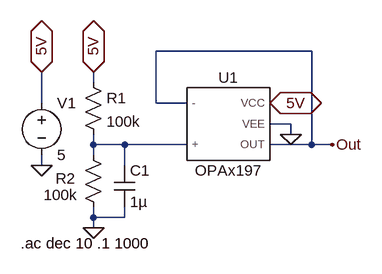
[diagram p0: schematic RefAmp197.asc]
RefAmp197.asc, the LTspice schematic file:
Version 4
SHEET 1 880 680
WIRE 416 64 176 64
WIRE 80 112 80 96
WIRE 0 144 0 96
WIRE 176 144 176 64
WIRE 224 144 176 144
WIRE 384 176 352 176
WIRE 384 192 384 176
WIRE 80 208 80 192
WIRE 128 208 80 208
WIRE 224 208 128 208
WIRE 416 208 416 64
WIRE 416 208 352 208
WIRE 448 208 416 208
WIRE 80 224 80 208
WIRE 0 240 0 224
WIRE 128 240 128 208
WIRE 80 320 80 304
WIRE 128 320 128 304
WIRE 128 320 80 320
WIRE 80 336 80 320
FLAG 80 336 0
FLAG 0 240 0
FLAG 384 192 0
FLAG 448 208 Out
FLAG 0 96 5V
IOPIN 0 96 BiDir
FLAG 80 96 5V
IOPIN 80 96 BiDir
FLAG 352 144 5V
IOPIN 352 144 BiDir
SYMBOL voltage 0 128 R0
WINDOW 123 0 0 Left 0
WINDOW 39 0 0 Left 0
SYMATTR InstName V1
SYMATTR Value 5
SYMBOL res 64 96 R0
SYMATTR InstName R1
SYMATTR Value 100k
SYMBOL res 64 208 R0
WINDOW 0 -42 52 Left 2
WINDOW 3 -61 77 Left 2
SYMATTR InstName R2
SYMATTR Value 100k
SYMBOL cap 112 240 R0
SYMATTR InstName C1
SYMATTR Value 1µ
SYMBOL AutoGenerated\\OPAx197 288 176 R0
SYMATTR InstName U1
TEXT -32 360 Left 2 !.ac dec 10 .1 1000

The netlist it stands for:
* RefAmp197.asc
V1 5V 0 5
R1 5V N001 100k
R2 N001 0 100k
C1 N001 0 1µ
XU1 N001 Out 5V 0 Out OPAx197  ; pins + - VCC VEE OUT
.ac dec 10 .1 1000
.lib C:\Users\bismi\OneDrive\Documents\LTspice\SPICEV2\OPAx197.LIB
.backanno
.end